# Altium schematic sheet Change Log.SchDoc
size B; Author: AM; CompanyName: Expatria Technologies; DrawnBy: A.Marles; Engineer: AM; Organization: Expatria Technolgoies; Address1: PO Box 2084; Address3: Merritt, BC V1K 1B8; Address4: Canada; DocumentNumber: 27; SheetNumber: 27; SheetTotal: 27
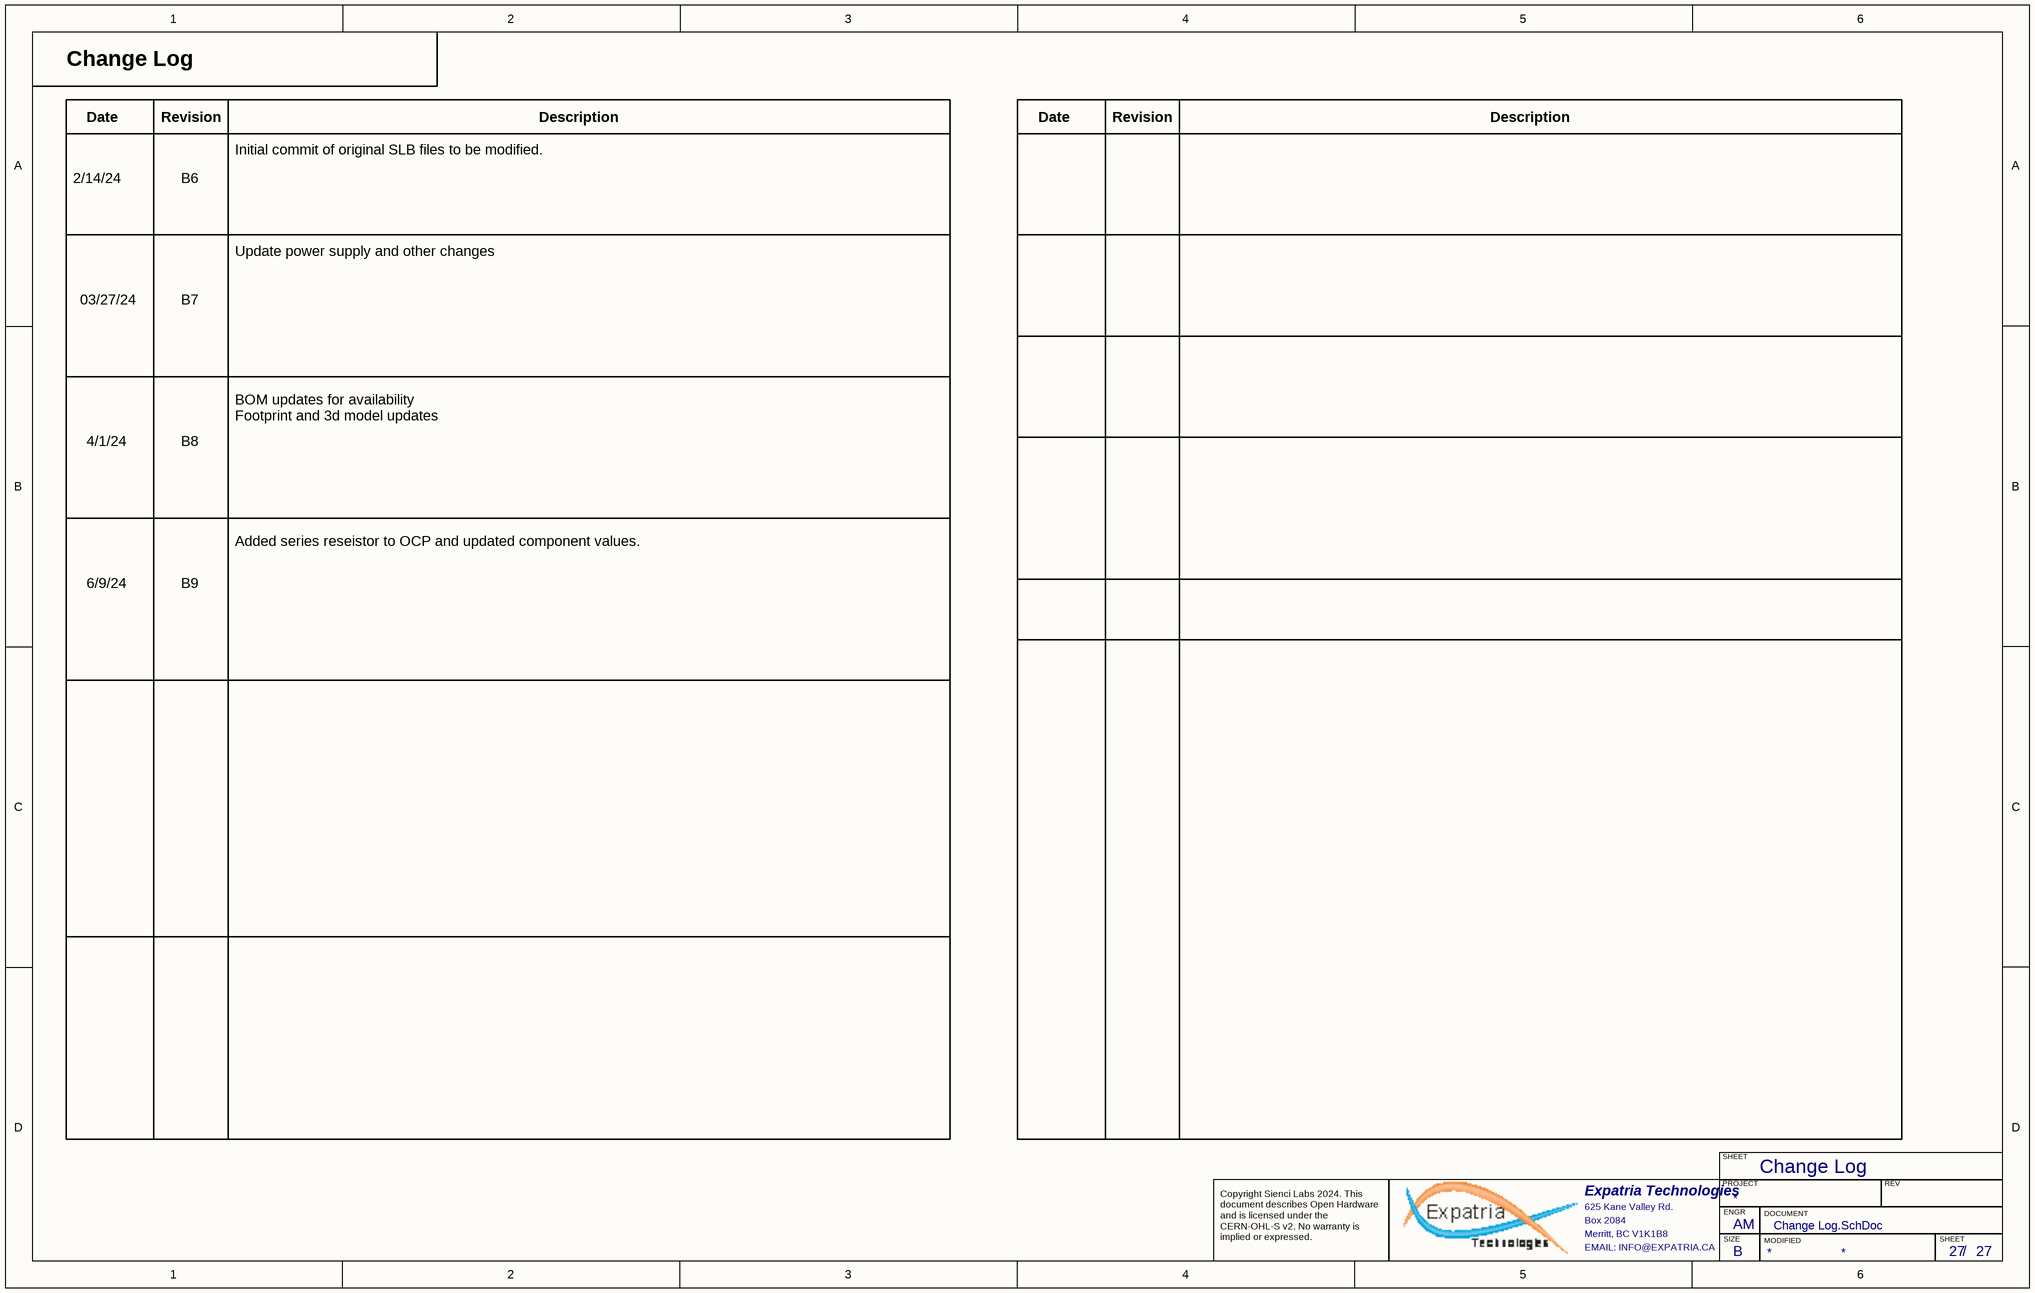
[diagram p0: Change Log.SchDoc]

## Notes on the sheet
- Change Log
- Date
- Revision
- Description
- 2/14/24
- B6
- Initial commit of original SLB files to be modified.
- 03/27/24
- B7
- Update power supply and other changes
- 4/1/24
- B8
- BOM updates for availability
  Footprint and 3d model updates
- 6/9/24
- B9
- Added series reseistor to OCP and updated component values.
- SHEET
- Expatria Technologies
- 625 Kane Valley Rd.
- Box 2084
- Merritt, BC V1K1B8
- PROJECT
- SIZE
- ENGR
- MODIFIED
- DOCUMENT
- REV
- Copyright Sienci Labs 2024. This document describes Open Hardware and is licensed under the CERN-OHL-S v2. No warranty is implied or expressed.
- EMAIL: INFO@EXPATRIA.CA
- B
- /